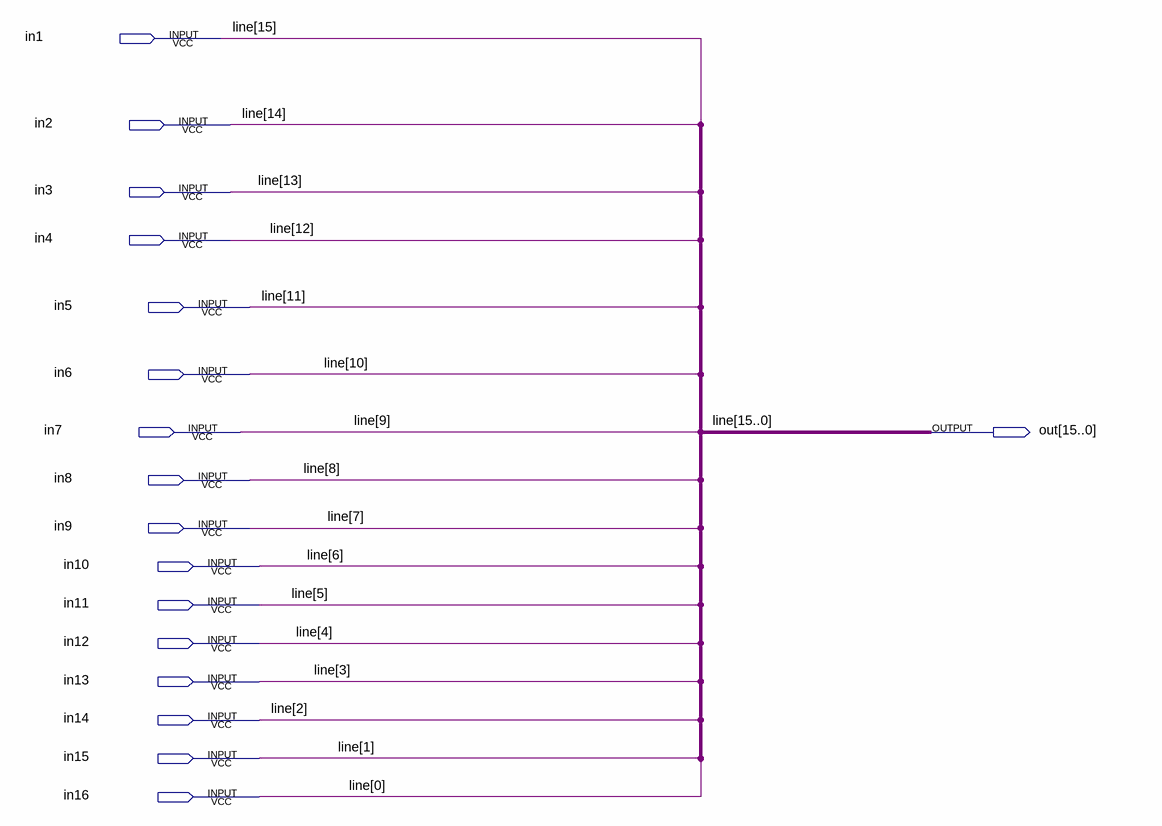
[diagram p0: schematic sheet]
// Quartus schematic 16merger.bdf as structural Verilog: 0 symbols, 17 pins
module \16merger  (
  input  in1,
  input  in2,
  input  in3,
  input  in4,
  input  in5,
  input  in6,
  input  in7,
  input  in8,
  input  in9,
  input  in10,
  input  in11,
  input  in12,
  input  in13,
  input  in14,
  input  in15,
  input  in16,
  output [15:0] out
);


  assign out = {in1, in2, in3, in4, in5, in6, in7, in8, in9, in10, in11, in12, in13, in14, in15, in16};

  // Other names for the same wires on the sheet: line[15:0] = {in1, in2, in3, in4, in5, in6, in7, in8, in9, in10, in11, in12, in13, in14, in15, in16}
endmodule
